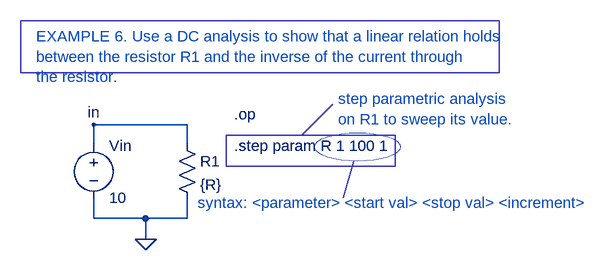
[diagram p0: schematic example-006.asc]
example-006.asc, the LTspice schematic file:
Version 4
SHEET 1 880 680
WIRE 32 112 -112 112
WIRE -112 144 -112 112
WIRE 32 144 32 112
WIRE -112 256 -112 224
WIRE -32 256 -112 256
WIRE 32 256 32 224
WIRE 32 256 -32 256
WIRE -32 288 -32 256
FLAG -32 288 0
FLAG -112 112 in
SYMBOL res 16 128 R0
SYMATTR InstName R1
SYMATTR Value {R}
SYMATTR SpiceLine tol=5
SYMBOL voltage -112 128 R0
WINDOW 123 0 0 Left 2
WINDOW 39 0 0 Left 2
SYMATTR InstName Vin
SYMATTR Value 10
TEXT 104 144 Left 2 !.step param R 1 100 1
TEXT 104 96 Left 2 !.op
TEXT -200 -24 Left 2 ;EXAMPLE 6. Use a DC analysis to show that a linear relation holds\nbetween the resistor R1 and the inverse of the current through\nthe resistor.
TEXT 264 72 Left 2 ;step parametric analysis\non R1 to sweep its value.
TEXT 48 232 Left 2 ;syntax: <parameter> <start val> <stop val> <increment>
LINE Normal 208 128 256 80
LINE Normal 288 168 272 224
RECTANGLE Normal -224 -48 512 32
RECTANGLE Normal 92 128 352 176
CIRCLE Normal 228 124 360 168 1

The netlist it stands for:
* example-006.asc
R1 in 0 {R} tol=5
Vin in 0 10
.step param R 1 100 1
.op
* EXAMPLE 6. Use a DC analysis to show that a linear relation holds
* between the resistor R1 and the inverse of the current through
* the resistor.
* step parametric analysis
* on R1 to sweep its value.
* syntax: <parameter> <start val> <stop val> <increment>
.backanno
.end